# Altium schematic sheet MCU.SchDoc
size A3
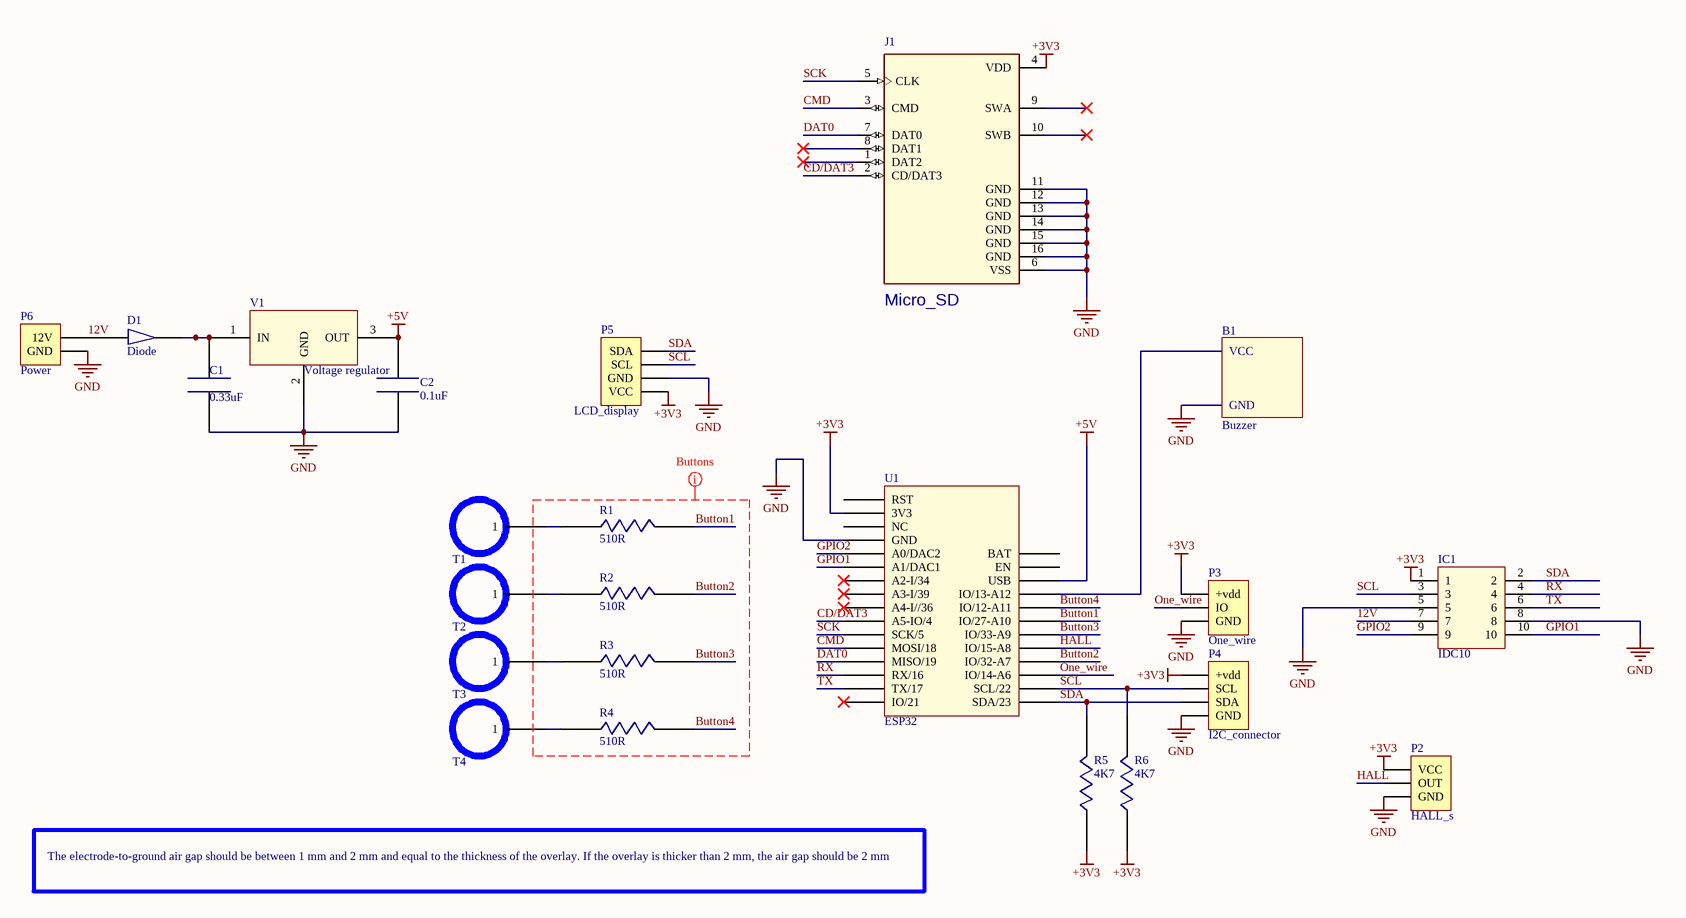
[diagram p0: MCU.SchDoc]

## Parts
B1  Buzzer  [Buzzer]
C1  0.33uF  [CAP0603]
C2  0.1uF  [CAP0603]
D1  Diode  [SODFL350X110-2N]
IC1  IDC10  [IDC10]
J1  Micro_SD  [TE_2201778-1]
P2  HALL_s  [HDR1X3]
P3  One_wire  [HDR1X3]
P4  I2C_connector  [HDR1X4]
P5  LCD_display  [LCD_display]
P6  Power  [HDR1X2]
R1  510R  [RES0603]
R2  510R  [RES0603]
R3  510R  [RES0603]
R4  510R  [RES0603]
R5  4K7  [RES0603]
R6  4K7  [RES0603]
T1  Touch button  [Touch_Button]  (value not drawn)
T2  Touch button  [Touch_Button]  (value not drawn)
T3  Touch button  [Touch_Button]  (value not drawn)
T4  Touch button  [Touch_Button]  (value not drawn)
U1  ESP32  [ESP32]
V1  Voltage regulator  [DPAK248P950X240-3N]

## Nets
+3V3: IC1.1 J1.4(VDD) P2.1(VCC) P3.1(+vdd) P4.1(+vdd) P5.1(VCC) R5.1 R6.1 U1.2(3V3)
+5V: C2.2 U1.26(USB) V1.3(OUT)
GND: B1.2(GND) C1.1 C2.1 IC1.5 IC1.8 J1.6(VSS) J1.11(GND) J1.12(GND) J1.13(GND) J1.14(GND) J1.15(GND) J1.16(GND) P2.3(GND) P3.3(GND) P4.4(GND) P5.2(GND) P6.1(GND) U1.4(GND) V1.2(GND)
12V: D1.2 IC1.7 P6.2(12V)
Button1: R1.2 U1.23(IO/27-A10)
Button2: R2.2 U1.20(IO/32-A7)
Button3: R3.2 U1.22(IO/33-A9)
Button4: R4.2 U1.24(IO/12-A11)
CD/DAT3: J1.2(CD/DAT3) U1.10(A5-IO/4)
CMD: J1.3(CMD) U1.12(MOSI/18)
DAT0: J1.7(DAT0) U1.13(MISO/19)
GPIO1: IC1.10 U1.6(A1/DAC1)
GPIO2: IC1.9 U1.5(A0/DAC2)
HALL: P2.2(OUT) U1.21(IO/15-A8)
One_wire: P3.2(IO) U1.19(IO/14-A6)
RX: IC1.4 U1.14(RX/16)
SCK: J1.5(CLK) U1.11(SCK/5)
SCL: IC1.3 P4.2(SCL) P5.3(SCL) R6.2 U1.18(SCL/22)
SDA: IC1.2 P4.3(SDA) P5.4(SDA) R5.2 U1.17(SDA/23)
TX: IC1.6 U1.15(TX/17)
NetB1_1: B1.1(VCC) U1.25(IO/13-A12)
NetC1_2: C1.2 D1.1 V1.1(IN)
NetR1_1: R1.1 T1.1
NetR2_1: R2.1 T2.1
NetR3_1: R3.1 T3.1
NetR4_1: R4.1 T4.1

Not connected (* = marked no-connect by the designer): J1 1(DAT2)* 8(DAT1)* 9(SWA)* 10(SWB)*; U1 1(RST) 3(NC) 7(A2-I/34)* 8(A3-I/39)* 9(A4-I//36)* 16(IO/21)* 27(EN) 28(BAT)

## Layout directives
net class Buttons: Button1, Button2, Button3, Button4

## Notes on the sheet
- The electrode-to-ground air gap should be between 1 mm and 2 mm and equal to the thickness of the overlay. If the overlay is thicker than 2 mm, the air gap should be 2 mm

## Library data of the parts
B1 = Buzzer: MULTICOMP         MCABT-458-RC            SOUNDER, 75DB, 1-25V, SMD; Supply Voltage Min: 1V; Supply Voltage Max: 25V; Tones: Single; Current Rating: 1mA; Resonant Frequency: 4kHz; SVHC: No SVHC (15-Jun-2015); Supplier 1: Farnell; Manufacturer: Multicomp; Manufacturer Part Number: MCABT-458-RC; Stock 1: 2929; Pricing 1: 1=1.84, 3=1.67, 5=1.53, 10=1.44, 20=1.18, 50=1.16, 250=1.13 (EUR); Sound Level SPL: 75dB; Transducer Function: Sounder; Transducer Mounting: SMD; Product Range: -; ComponentLink1URL: http://www.farnell.com/datasheets/1860703.pdf; ComponentLink1Description: http://www.farnell.com/datasheets/1860703.pdf
C1 = 0.33uF: 0.33µF ±10% 50V X7R Ceramic Capacitor -55°C ~ 125°C Surface Mount, MLCC 0603 (1608 Metric) 0.063" L x 0.031" W (1.60mm x 0.80mm); Manufacturer: TDK; Manufacturer Part Number: C1608X7R1H334K080AC; PCN Part Number: MLCC Part Number Change 30/Nov/2012; Product Training Modules: C Series General Applications SEAT, CCV, and TVCL Design Tools Guide to Replacing an Electrolytic Capacitor with an MLCC; Catalog Drawings: C SERIES_0603_0.95; Design Resources: 20 W Non-Isolated Buck LED Driver Using PL LNK460KG; EDA / CAD Models: Download from Accelerated Designs; Online Catalog: C Series, General Purpose; Other Names: 445-5950-6; Supplier 1: Farnell; Stock 1: 268000; Pricing 1: 4000=0.0692 (EUR); RoHS Information: RoHS Certificate-MLCC; Standard Package: 1; Category: Capacitors; Family: Ceramic Capacitors; Series: C; Packaging: Digi-Reel®; Capacitance: 0.33µF; Tolerance: ±10%; Voltage - Rated: 50V; Temperature Coefficient: X7R; Mounting Type: Surface Mount, MLCC; Operating Temperature: -55°C ~ 125°C; Applications: General Purpose; Package / Case: 0603 (1608 Metric); Size / Dimension: 0.063" L x 0.031" W (1.60mm x 0.80mm); Thickness (Max): 0.037" (0.95mm); ComponentLink1URL: https://datasheet.ciiva.com/24216/c1608x7r1h334k080ac-264671-24216479.pdf; ComponentLink1Description: https://datasheet.ciiva.com/24216/c1608x7r1h334k080ac-264671-24216479.pdf; ComponentLink2URL: https://datasheet.ciiva.com/22718/1796654-22718021.pdf; ComponentLink2Description: https://datasheet.ciiva.com/22718/1796654-22718021.pdf; ComponentLink3URL: https://datasheet.ciiva.com/6290/tdkmlcccaprange-6290791.pdf; ComponentLink3Description: https://datasheet.ciiva.com/6290/tdkmlcccaprange-6290791.pdf; ComponentLink4URL: https://datasheet.ciiva.com/16427/general-b11-16427753.pdf; ComponentLink4Description: https://datasheet.ciiva.com/16427/general-b11-16427753.pdf; ComponentLink5URL: https://datasheet.ciiva.com/23803/1735394-23803004.pdf; ComponentLink5Description: https://datasheet.ciiva.com/23803/1735394-23803004.pdf; ComponentLink6URL: https://datasheet.ciiva.com/28451/1796654-28451356.pdf; ComponentLink6Description: https://datasheet.ciiva.com/28451/1796654-28451356.pdf; ComponentLink7URL: https://datasheet.ciiva.com/6290/tdkmlcccaprange-6290782.pdf; ComponentLink7Description: https://datasheet.ciiva.com/6290/tdkmlcccaprange-6290782.pdf; Supplier Part Number 1: 2522009
C2 = 0.1uF: CAP CER 0.1UF 50V X7R 0603; Manufacturer: Kyocera AVX; Manufacturer Part Number: 06035C104K4Z2A; Brand: AVX; Capacitance - nF: 100 nF; Capacitance - pF: 100000 pF; Case Height: 0.035 mm; Case Length: 1.6 mm; Case Width: 0.81 mm; Dissipation Factor DF: 2.5; Tolerance: 10 %; Temperature Coefficient / Code: +/- 15 %; Type: Automotive MLCCs X7R Dielectric, Flexiterm; Supplier 1: Farnell; Stock 1: 0; Capacitance: 0.1 uF; Case Code - in: 0603; Case Code - mm: 1608; Dimensions: 0.81 mm W x 1.6 mm L x 0.035 mm H; Dielectric: X7R; Factory Pack Quantity: 4000; Voltage Rating: 50 V; Product Category: Multilayer Ceramic Capacitors MLCC - SMD/SMT; RoHS: Details; Minimum Operating Temperature: - 55 C; Maximum Operating Temperature: + 125 C; Product: Automotive MLCCs; Operating Temperature Range: - 55 C to + 125 C; Package / Case: 0603 (1608 metric); Packaging: Reel; Series: 0603 C; Termination: Flexible (Soft); Termination Style: SMD/SMT; Tradename: FLEXITERM; Voltage Rating DC: 50 V; ComponentLink1URL: https://datasheet.ciiva.com/17495/flexiterm-17495077.pdf; ComponentLink1Description: https://datasheet.ciiva.com/17495/flexiterm-17495077.pdf; ComponentLink2URL: https://datasheet.ciiva.com/153/flexiterm-153369.pdf; ComponentLink2Description: https://datasheet.ciiva.com/153/flexiterm-153369.pdf; ComponentLink3URL: https://datasheet.ciiva.com/153/flexiterm-153370.pdf; ComponentLink3Description: https://datasheet.ciiva.com/153/flexiterm-153370.pdf; ComponentLink4URL: https://datasheet.ciiva.com/15212/getdatasheetpartid-494917-15212298.pdf; ComponentLink4Description: https://datasheet.ciiva.com/15212/getdatasheetpartid-494917-15212298.pdf; ComponentLink5URL: https://datasheet.ciiva.com/153/flexiterm-153371.pdf; ComponentLink5Description: https://datasheet.ciiva.com/153/flexiterm-153371.pdf; ComponentLink6URL: https://datasheet.ciiva.com/22707/1679506-22707787.pdf; ComponentLink6Description: https://datasheet.ciiva.com/22707/1679506-22707787.pdf; ComponentLink7URL: https://datasheet.ciiva.com/1457/1679506-1457868.pdf; ComponentLink7Description: https://datasheet.ciiva.com/1457/1679506-1457868.pdf; Supplier Part Number 1: 1833843RL
D1 = 20V,1A, SOD-123: NXP         PMEG2010ER             Schottky Rectifier, Single, 20 V, 1 A, SOD-123W, 2 Pins, 340 mV; Manufacturer: NXP Semiconductors; Maximum Continuous Forward Current: 1A; Number of Elements per Chip: 1; Peak Reverse Repetitive Voltage: 20V; Peak Forward Voltage: 340mV; Peak Reverse Current: 1mA; Supplier 1: Farnell; Manufacturer Part Number: PMEG2010ER; Stock 1: 5091; Pricing 1: 5=0.314, 25=0.196, 100=0.147, 250=0.141, 500=0.0849, 1000=0.075, 5000=0.0735 (EUR); Diode Configuration: Single; Mounting Type: Surface Mount; Package Type: SOD-123; Diode Type: Schottky; Pin Count: 2; Length: 2.8mm; Width: 1.9mm; Height: 1.1mm; Dimensions: 2.8 x 1.9 x 1.1mm; Maximum Operating Temperature: +150 °C; Minimum Operating Temperature: -55 °C; ComponentLink1URL: https://datasheet.ciiva.com/5727/1760771-5727088.pdf; ComponentLink1Description: https://datasheet.ciiva.com/5727/1760771-5727088.pdf; ComponentLink2URL: https://datasheet.ciiva.com/22696/1383341-22696483.pdf; ComponentLink2Description: https://datasheet.ciiva.com/22696/1383341-22696483.pdf; ComponentLink3URL: https://datasheet.ciiva.com/7965/1383341-7965062.pdf; ComponentLink3Description: https://datasheet.ciiva.com/7965/1383341-7965062.pdf; Supplier Part Number 1: 1907681
IC1 = IDC10: BOX HEADER 2.54MM MALE STR 10POS; Manufacturer: Wurth Electronics; Manufacturer Part Number: 61201021621; Number of Positions: 10 Position; Mounting Angle: Horizontal; Current Rating: 3 A; Insulation Resistance: 1000 MOhms; Voltage Rating: 250 V; Supplier 1: Farnell; Stock 1: 0; Product Category: Headers & Wire Housings; RoHS: True; Product: Headers; Type: Shrouded; Pitch: 2.54 mm; Number of Rows: 2 Row; Mounting Style: Through Hole; Termination Style: Solder; Contact Gender: Pin (Male); Contact Plating: Gold; Series: WR-BHD; Application: Wire-to-Board; Brand: Wurth Electronics; Contact Material: Copper Alloy; Flammability Rating: UL 94 V-0; Housing Material: Polybutylene Terephthalate (PBT); Operating Temperature Range: - 40 C to + 125 C; Packaging: Tray; ComponentLink1URL: https://datasheet.ciiva.com/731/6120xx21621-731344.pdf; ComponentLink1Description: https://datasheet.ciiva.com/731/6120xx21621-731344.pdf; ComponentLink2URL: https://datasheet.ciiva.com/15395/6120xx21621-265834-15395106.pdf; ComponentLink2Description: https://datasheet.ciiva.com/15395/6120xx21621-265834-15395106.pdf; ComponentLink3URL: https://datasheet.ciiva.com/7648/76595-7648121.pdf; ComponentLink3Description: https://datasheet.ciiva.com/7648/76595-7648121.pdf; Supplier Part Number 1: 1642019
J1 = 2201778-1: MICRO SD PUSH PUSH LOW PROFILE TYPE; Product_Type: Removable Memory Products; Centerline_Pitch: 1.1 mm[.04 in]; MF: TE Connectivity; Number_of_Positions: 8; SnapEDA_Link: https://www.snapeda.com/parts/2201778-1/TE%20Connectivity%20AMP%20Connectors/view-part/?ref=snap; Link: http://www.te.com/usa-en/product-2201778-1.html; Availability: Good; MP: 2201778-1; Price: 1.95 USD; Package: None; EU_RoHS_Compliance: Compliant; Value: *
P2 P3 = Header 3: Header, 3-Pin; LatestRevisionDate: 17-Jul-2002; LatestRevisionNote: Re-released for DXP Platform.; Publisher: Altium Limited
P4 P5 = Header 4: Header, 4-Pin; LatestRevisionDate: 17-Jul-2002; LatestRevisionNote: Re-released for DXP Platform.; Publisher: Altium Limited
P6 = Header 2: Header, 2-Pin; LatestRevisionDate: 17-Jul-2002; LatestRevisionNote: Re-released for DXP Platform.; Publisher: Altium Limited
R1-R4 = 510R: Res Thick Film 0603 510 Ohm 1% 0.1W(1/10W) ±100ppm/C Molded SMD Automotive Punched T/R; Manufacturer: Panasonic; Manufacturer Part Number: ERJ-3EKF5100V; Temperature Coefficient: ± 100ppm/°C; SVHC: To Be Advised; Product Range: PANASONIC - ERJ Series Thick Film Chip Resistors; Resistance: 510ohm; Power Rating: 100mW; Resistor Case Style: 0603 ^1608 Metric]; Voltage Rating: 75V; Supplier 1: Farnell; Stock 1: 28364; Pricing 1: 10=0.0416, 100=0.0243, 500=0.0183, 1000=0.0164 (EUR); Resistor Element Type: Thick Film; Packaging: Full Reel; Resistance Tolerance: ± 1%; ComponentLink1URL: https://datasheet.ciiva.com/9181/aoa0000ce2-9181526.pdf; ComponentLink1Description: https://datasheet.ciiva.com/9181/aoa0000ce2-9181526.pdf; ComponentLink2URL: https://datasheet.ciiva.com/28565/1678782-28565126.pdf; ComponentLink2Description: https://datasheet.ciiva.com/28565/1678782-28565126.pdf; ComponentLink3URL: https://datasheet.ciiva.com/16787/70260748-16787975.pdf; ComponentLink3Description: https://datasheet.ciiva.com/16787/70260748-16787975.pdf; ComponentLink4URL: https://datasheet.ciiva.com/46436/426256-46436792.pdf; ComponentLink4Description: https://datasheet.ciiva.com/46436/426256-46436792.pdf; ComponentLink5URL: https://datasheet.ciiva.com/24027/aoa0000ce2-24027562.pdf; ComponentLink5Description: https://datasheet.ciiva.com/24027/aoa0000ce2-24027562.pdf; ComponentLink6URL: https://datasheet.ciiva.com/28676/1678782-28676970.pdf; ComponentLink6Description: https://datasheet.ciiva.com/28676/1678782-28676970.pdf; ComponentLink7URL: https://datasheet.ciiva.com/16514/aoa0000ce2-16514091.pdf; ComponentLink7Description: https://datasheet.ciiva.com/16514/aoa0000ce2-16514091.pdf; ComponentLink8URL: https://datasheet.ciiva.com/5868/426256-5868140.pdf; ComponentLink8Description: https://datasheet.ciiva.com/5868/426256-5868140.pdf; ComponentLink9URL: https://datasheet.ciiva.com/9181/aoa0000ce2-9181437.pdf; ComponentLink9Description: https://datasheet.ciiva.com/9181/aoa0000ce2-9181437.pdf; ComponentLink10URL: https://datasheet.ciiva.com/16775/70260748-16775519.pdf; ComponentLink10Description: https://datasheet.ciiva.com/16775/70260748-16775519.pdf; ComponentLink11URL: https://datasheet.ciiva.com/30146/aoa0000ce2-30146815.pdf; ComponentLink11Description: https://datasheet.ciiva.com/30146/aoa0000ce2-30146815.pdf; Supplier Part Number 1: 2059312
R5 R6 = 4K7: Res Thick Film 0603 4.7K Ohm 1% 0.1W(1/10W) ±100ppm/C Molded SMD Automotive T/R; Manufacturer: Panasonic; Manufacturer Part Number: ERJ-3EKF4701V; Resistance: 4.7 kOhms; Power Rating: 100 mW; Voltage Rating: 75 V; Qualification: AEC-Q200; Unit Weight: 0.000071 oz; Supplier 1: Farnell; Stock 1: 240000; Pricing 1: 5000=0.0123, 25000=0.0099 (EUR); Product Category: Thick Film Resistors; RoHS: True; Tolerance: 1 %; Case Code - in: 0603; Temperature Coefficient: 100 PPM / C; Case Code - mm: 1608; Operating Temperature Range: - 55 C to + 155 C; Series: ERJ; Type: Precision Thick Film Resistors SMD; Brand: Panasonic; Height: 0.45 mm; Length: 1.6 mm; Package / Case: 0603 (1608 metric); Packaging: Reel; Product: Thick Film Resistors SMD; Factory Pack Quantity: 5000; Termination Style: SMD/SMT; Width: 0.8 mm; ComponentLink1URL: https://datasheet.ciiva.com/16449/aoa0000ce2-16449479.pdf; ComponentLink1Description: https://datasheet.ciiva.com/16449/aoa0000ce2-16449479.pdf; ComponentLink2URL: https://datasheet.ciiva.com/16511/aoa0000ce2-16511783.pdf; ComponentLink2Description: https://datasheet.ciiva.com/16511/aoa0000ce2-16511783.pdf; ComponentLink3URL: https://datasheet.ciiva.com/7830/426256-7830985.pdf; ComponentLink3Description: https://datasheet.ciiva.com/7830/426256-7830985.pdf; ComponentLink4URL: https://datasheet.ciiva.com/9195/aoa0000ce2-9195740.pdf; ComponentLink4Description: https://datasheet.ciiva.com/9195/aoa0000ce2-9195740.pdf; ComponentLink5URL: https://datasheet.ciiva.com/46372/1678782-46372716.pdf; ComponentLink5Description: https://datasheet.ciiva.com/46372/1678782-46372716.pdf; ComponentLink6URL: https://datasheet.ciiva.com/16758/70260748-16758189.pdf; ComponentLink6Description: https://datasheet.ciiva.com/16758/70260748-16758189.pdf; ComponentLink7URL: https://datasheet.ciiva.com/24160/aoa0000ce2-24160445.pdf; ComponentLink7Description: https://datasheet.ciiva.com/24160/aoa0000ce2-24160445.pdf; ComponentLink8URL: https://datasheet.ciiva.com/46372/1678782-46372717.pdf; ComponentLink8Description: https://datasheet.ciiva.com/46372/1678782-46372717.pdf; ComponentLink9URL: https://datasheet.ciiva.com/17213/aoa0000ce2-17213182.pdf; ComponentLink9Description: https://datasheet.ciiva.com/17213/aoa0000ce2-17213182.pdf; ComponentLink10URL: https://datasheet.ciiva.com/7830/aoa0000ce2-7830735.pdf; ComponentLink10Description: https://datasheet.ciiva.com/7830/aoa0000ce2-7830735.pdf; Supplier Part Number 1: 2397726
U1 = 3405: Dip connectro for MCU; Manufacturer: Adafruit Industries; Supplier 1: Digi-Key; Manufacturer Part Number: 3405; Stock 1: 276; Pricing 1: 1=19.95 (USD); ComponentLink1URL: https://espressif.com/sites/default/files/documentation/esp32_datasheet_en.pdf; ComponentLink1Description: https://espressif.com/sites/default/files/documentation/esp32_datasheet_en.pdf; Supplier Part Number 1: 1528-2181-ND
V1 = 5-20V: FAIRCHILD SEMICONDUCTOR         KA7805ERTF             Linear Voltage Regulator, 7805, Fixed, 10V To 35V In, 5V And 1A Out, TO-252-3; Manufacturer: ON Semiconductor / Fairchild; Minimum Input Voltage: 7 V; Maximum Input Voltage: 25 V; Number of Outputs: 1; Polarity: Positive; Typical Dropout Voltage @ Current: 2 V @ 1 A; Quiescent Current: 8mA; Load Regulation: 100 mV; Supplier 1: Farnell; Manufacturer Part Number: KA7805ERTF; Stock 1: 0; Output Voltage: 5 V; Maximum Output Current: 1A; Package Type: DPAK; Output Type: Fixed; Mounting Type: Surface Mount; Regulator Function: Linear; Pin Count: 3; Minimum Operating Temperature: 0 °C; Maximum Operating Temperature: +125 °C; Series: KA78xx; Height: 2.38mm; Width: 6.22mm; Dropout Voltage Measurement Current: 1 A; Dimensions: 6.73 x 6.22 x 2.38mm; Length: 6.73mm; Line Regulation: 100 mV; ComponentLink1URL: https://datasheet.ciiva.com/26180/ka7824e-26180282.pdf; ComponentLink1Description: https://datasheet.ciiva.com/26180/ka7824e-26180282.pdf; ComponentLink2URL: https://datasheet.ciiva.com/1511/1747520-1511515.pdf; ComponentLink2Description: https://datasheet.ciiva.com/1511/1747520-1511515.pdf; ComponentLink3URL: https://datasheet.ciiva.com/3224/ka7824e-3224876.pdf; ComponentLink3Description: https://datasheet.ciiva.com/3224/ka7824e-3224876.pdf; ComponentLink4URL: https://datasheet.ciiva.com/7658/1747520-7658876.pdf; ComponentLink4Description: https://datasheet.ciiva.com/7658/1747520-7658876.pdf; ComponentLink5URL: https://datasheet.ciiva.com/6592/ka7805e-6592445.pdf; ComponentLink5Description: https://datasheet.ciiva.com/6592/ka7805e-6592445.pdf; ComponentLink6URL: https://datasheet.ciiva.com/6592/ka7805e-6592446.pdf; ComponentLink6Description: https://datasheet.ciiva.com/6592/ka7805e-6592446.pdf; ComponentLink7URL: https://datasheet.ciiva.com/6592/ka7805e-6592463.pdf; ComponentLink7Description: https://datasheet.ciiva.com/6592/ka7805e-6592463.pdf; ComponentLink8URL: https://datasheet.ciiva.com/48694/001252964-da-01-en-ic-reg-ldo-5v-1a-ka7805ertf-to-252-3-fsc-48694758.pdf; ComponentLink8Description: https://datasheet.ciiva.com/48694/001252964-da-01-en-ic-reg-ldo-5v-1a-ka7805ertf-to-252-3-fsc-48694758.pdf; Supplier Part Number 1: 2102585RL